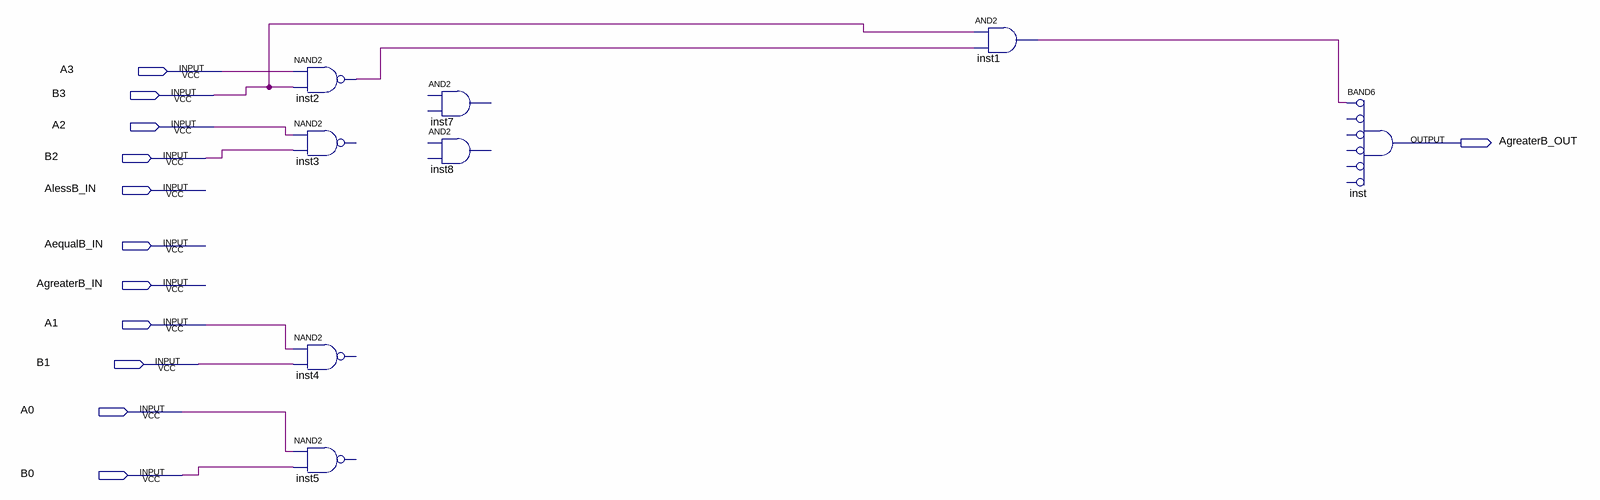
[diagram p0: schematic sheet]
// Quartus schematic comp.bdf as structural Verilog: 8 symbols, 12 pins
module comp (
  input  A3,
  input  B3,
  input  A2,
  input  B2,
  input  AlessB_IN,
  input  AequalB_IN,
  input  AgreaterB_IN,
  input  A1,
  input  B1,
  input  A0,
  input  B0,
  output AgreaterB_OUT
);

  wire inst1_out, inst2_out;

  nand inst2 (inst2_out, A3, B3);
  // NAND2 inst3 has open pins: IN1=A2, IN2=B2, OUT=open
  // NAND2 inst4 has open pins: IN1=A1, IN2=B1, OUT=open
  // NAND2 inst5 has open pins: IN1=A0, IN2=B0, OUT=open
  // AND2 inst7 is placed but not wired
  // AND2 inst8 is placed but not wired
  and inst1 (inst1_out, B3, inst2_out);
  buf inst (AgreaterB_OUT, ~inst1_out);  // BAND6 BAND6 open: IN2, IN3, IN4, IN5, IN6
endmodule
